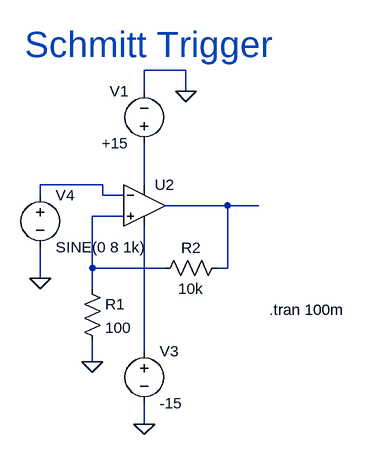
[diagram p0: schematic Schmitt Trigger.asc]
Schmitt Trigger.asc, the LTspice schematic file:
Version 4.1
SHEET 1 880 680
WIRE -1920 -848 -1984 -848
WIRE -1984 -816 -1984 -848
WIRE -1920 -816 -1920 -848
WIRE -2048 -672 -2144 -672
WIRE -1984 -672 -1984 -736
WIRE -2144 -656 -2144 -672
WIRE -2048 -656 -2048 -672
WIRE -2016 -656 -2048 -656
WIRE -1856 -640 -1952 -640
WIRE -1808 -640 -1856 -640
WIRE -2016 -624 -2064 -624
WIRE -2064 -544 -2064 -624
WIRE -1952 -544 -2064 -544
WIRE -1856 -544 -1856 -640
WIRE -1856 -544 -1872 -544
WIRE -2144 -528 -2144 -576
WIRE -2064 -512 -2064 -544
WIRE -1984 -416 -1984 -608
WIRE -2064 -400 -2064 -432
WIRE -1984 -304 -1984 -336
FLAG -2064 -400 0
FLAG -2144 -528 0
FLAG -1920 -816 0
FLAG -1984 -304 0
SYMBOL res -2080 -528 R0
SYMATTR InstName R1
SYMATTR Value 100
SYMBOL res -1856 -560 R90
WINDOW 0 0 56 VBottom 2
WINDOW 3 32 56 VTop 2
SYMATTR InstName R2
SYMATTR Value 10k
SYMBOL voltage -1984 -720 R180
WINDOW 0 24 96 Left 2
WINDOW 3 24 16 Left 2
WINDOW 123 0 0 Left 0
WINDOW 39 0 0 Left 0
SYMATTR InstName V1
SYMATTR Value +15
SYMBOL voltage -1984 -432 R0
WINDOW 123 0 0 Left 0
WINDOW 39 0 0 Left 0
SYMATTR InstName V3
SYMATTR Value -15
SYMBOL voltage -2144 -672 R0
WINDOW 123 0 0 Left 0
WINDOW 39 0 0 Left 0
SYMATTR InstName V4
SYMATTR Value SINE(0 8 1k)
SYMBOL OpAmps\\UniversalOpAmp2 -1984 -640 R0
SYMATTR InstName U2
TEXT -1792 -480 Left 2 !.tran 100m
TEXT -2168 -888 Left 5 ;Schmitt Trigger

The netlist it stands for:
* Schmitt Trigger.asc
R1 N004 0 100
R2 N003 N004 10k
V1 N002 0 +15
V3 N005 0 -15
V4 N001 0 SINE(0 8 1k)
X§U2 N004 N001 N002 N005 N003 level2 Avol=1Meg GBW=10Meg Slew=10Meg Ilimit=25m Rail=0 Vos=0 En=0 Enk=0 In=0 Ink=0 Rin=500Meg  ; pins In+ In- V+ V- OUT
.tran 100m
* Schmitt Trigger
.lib UniversalOpAmp2.lib
.backanno
.end